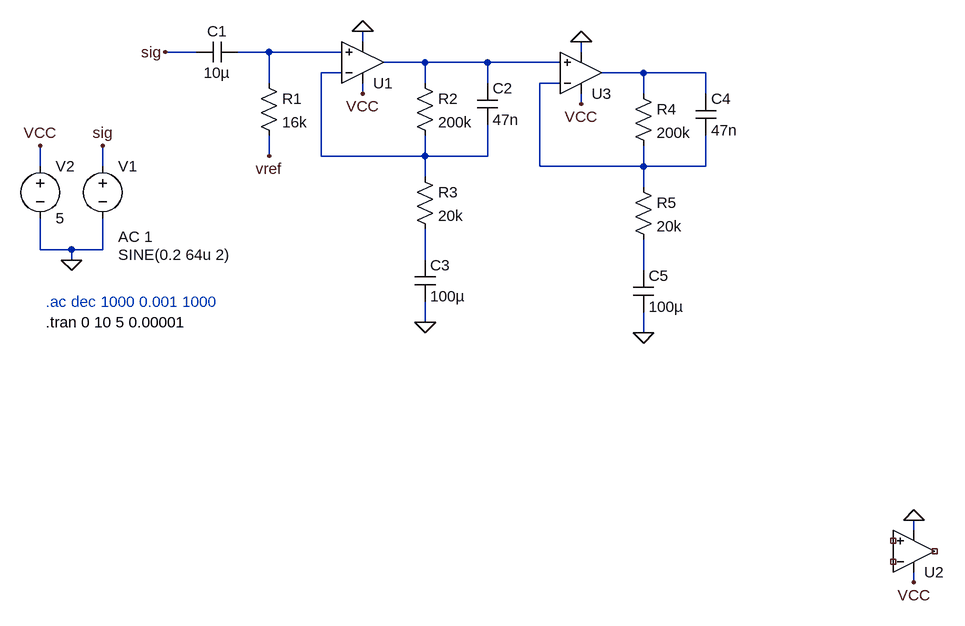
[diagram p0: schematic IF_amp_V5.asc]
IF_amp_V5.asc, the LTspice schematic file:
Version 4.1
SHEET 1 1188 956
WIRE 288 32 288 16
WIRE 32 48 -16 48
WIRE 144 48 96 48
WIRE 256 48 144 48
WIRE 624 48 624 32
WIRE 384 64 320 64
WIRE 480 64 384 64
WIRE 592 64 480 64
WIRE 256 80 224 80
WIRE 720 80 656 80
WIRE 816 80 720 80
WIRE 144 96 144 48
WIRE 384 96 384 64
WIRE 480 96 480 64
WIRE 592 96 560 96
WIRE 288 112 288 96
WIRE 720 112 720 80
WIRE 816 112 816 80
WIRE 624 128 624 112
WIRE 144 208 144 176
WIRE 224 208 224 80
WIRE 384 208 384 176
WIRE 384 208 224 208
WIRE 480 208 480 160
WIRE 480 208 384 208
WIRE -208 224 -208 192
WIRE -112 224 -112 192
WIRE 560 224 560 96
WIRE 720 224 720 192
WIRE 720 224 560 224
WIRE 816 224 816 176
WIRE 816 224 720 224
WIRE 384 240 384 208
WIRE 720 256 720 224
WIRE -208 352 -208 304
WIRE -160 352 -208 352
WIRE -112 352 -112 304
WIRE -112 352 -160 352
WIRE -160 368 -160 352
WIRE 384 368 384 320
WIRE 720 384 720 336
WIRE 384 464 384 432
WIRE 720 480 720 448
WIRE 1136 784 1136 768
WIRE 1136 864 1136 848
FLAG 288 16 0
FLAG 288 112 VCC
FLAG 1136 768 0
FLAG 1136 864 VCC
FLAG 144 208 vref
FLAG 384 464 0
FLAG -16 48 sig
FLAG -160 368 0
FLAG -112 192 sig
FLAG -208 192 VCC
FLAG 624 32 0
FLAG 624 128 VCC
FLAG 720 480 0
SYMBOL OpAmps\\UniversalOpAmp2 288 64 M180
SYMATTR InstName U1
SYMBOL cap 96 32 R90
WINDOW 0 0 32 VBottom 2
WINDOW 3 32 32 VTop 2
SYMATTR InstName C1
SYMATTR Value 10µ
SYMBOL res 128 80 R0
SYMATTR InstName R1
SYMATTR Value 16k
SYMBOL OpAmps\\UniversalOpAmp2 1136 816 M180
SYMATTR InstName U2
SYMBOL res 368 80 R0
SYMATTR InstName R2
SYMATTR Value 200k
SYMBOL cap 464 96 R0
SYMATTR InstName C2
SYMATTR Value 47n
SYMBOL res 368 224 R0
SYMATTR InstName R3
SYMATTR Value 20k
SYMBOL cap 368 368 R0
SYMATTR InstName C3
SYMATTR Value 100µ
SYMBOL voltage -112 208 R0
WINDOW 3 24 152 Left 2
WINDOW 123 24 124 Left 2
WINDOW 39 0 0 Left 0
SYMATTR InstName V1
SYMATTR Value SINE(0.2 64u 2)
SYMATTR Value2 AC 1
SYMBOL voltage -208 208 R0
WINDOW 123 0 0 Left 0
WINDOW 39 0 0 Left 0
SYMATTR InstName V2
SYMATTR Value 5
SYMBOL OpAmps\\UniversalOpAmp2 624 80 M180
SYMATTR InstName U3
SYMBOL res 704 96 R0
SYMATTR InstName R4
SYMATTR Value 200k
SYMBOL cap 800 112 R0
SYMATTR InstName C4
SYMATTR Value 47n
SYMBOL res 704 240 R0
SYMATTR InstName R5
SYMATTR Value 20k
SYMBOL cap 704 384 R0
SYMATTR InstName C5
SYMATTR Value 100µ
TEXT -200 432 Left 2 ;.ac dec 1000 0.001 1000
TEXT -200 464 Left 2 !.tran 0 10 5 0.00001

The netlist it stands for:
* IF_amp_V5.asc
X§U1 N001 N003 VCC 0 N002 level2 Avol=1Meg GBW=10Meg Slew=10Meg Ilimit=25m Rail=0 Vos=0 En=0 Enk=0 In=0 Ink=0 Rin=500Meg  ; pins In+ In- V+ V- OUT
C1 N001 sig 10µ
R1 N001 vref 16k
X§U2 NC_01 NC_02 VCC 0 NC_03 level2 Avol=1Meg GBW=10Meg Slew=10Meg Ilimit=25m Rail=0 Vos=0 En=0 Enk=0 In=0 Ink=0 Rin=500Meg  ; pins In+ In- V+ V- OUT
R2 N002 N003 200k
C2 N002 N003 47n
R3 N003 N006 20k
C3 N006 0 100µ
V1 sig 0 SINE(0.2 64u 2) AC 1
V2 VCC 0 5
X§U3 N002 N005 VCC 0 N004 level2 Avol=1Meg GBW=10Meg Slew=10Meg Ilimit=25m Rail=0 Vos=0 En=0 Enk=0 In=0 Ink=0 Rin=500Meg  ; pins In+ In- V+ V- OUT
R4 N004 N005 200k
C4 N004 N005 47n
R5 N005 N007 20k
C5 N007 0 100µ
* .ac dec 1000 0.001 1000
.tran 0 10 5 0.00001
.lib UniversalOpAmp2.lib
.backanno
.end